# Altium project Задание.PrjPcb
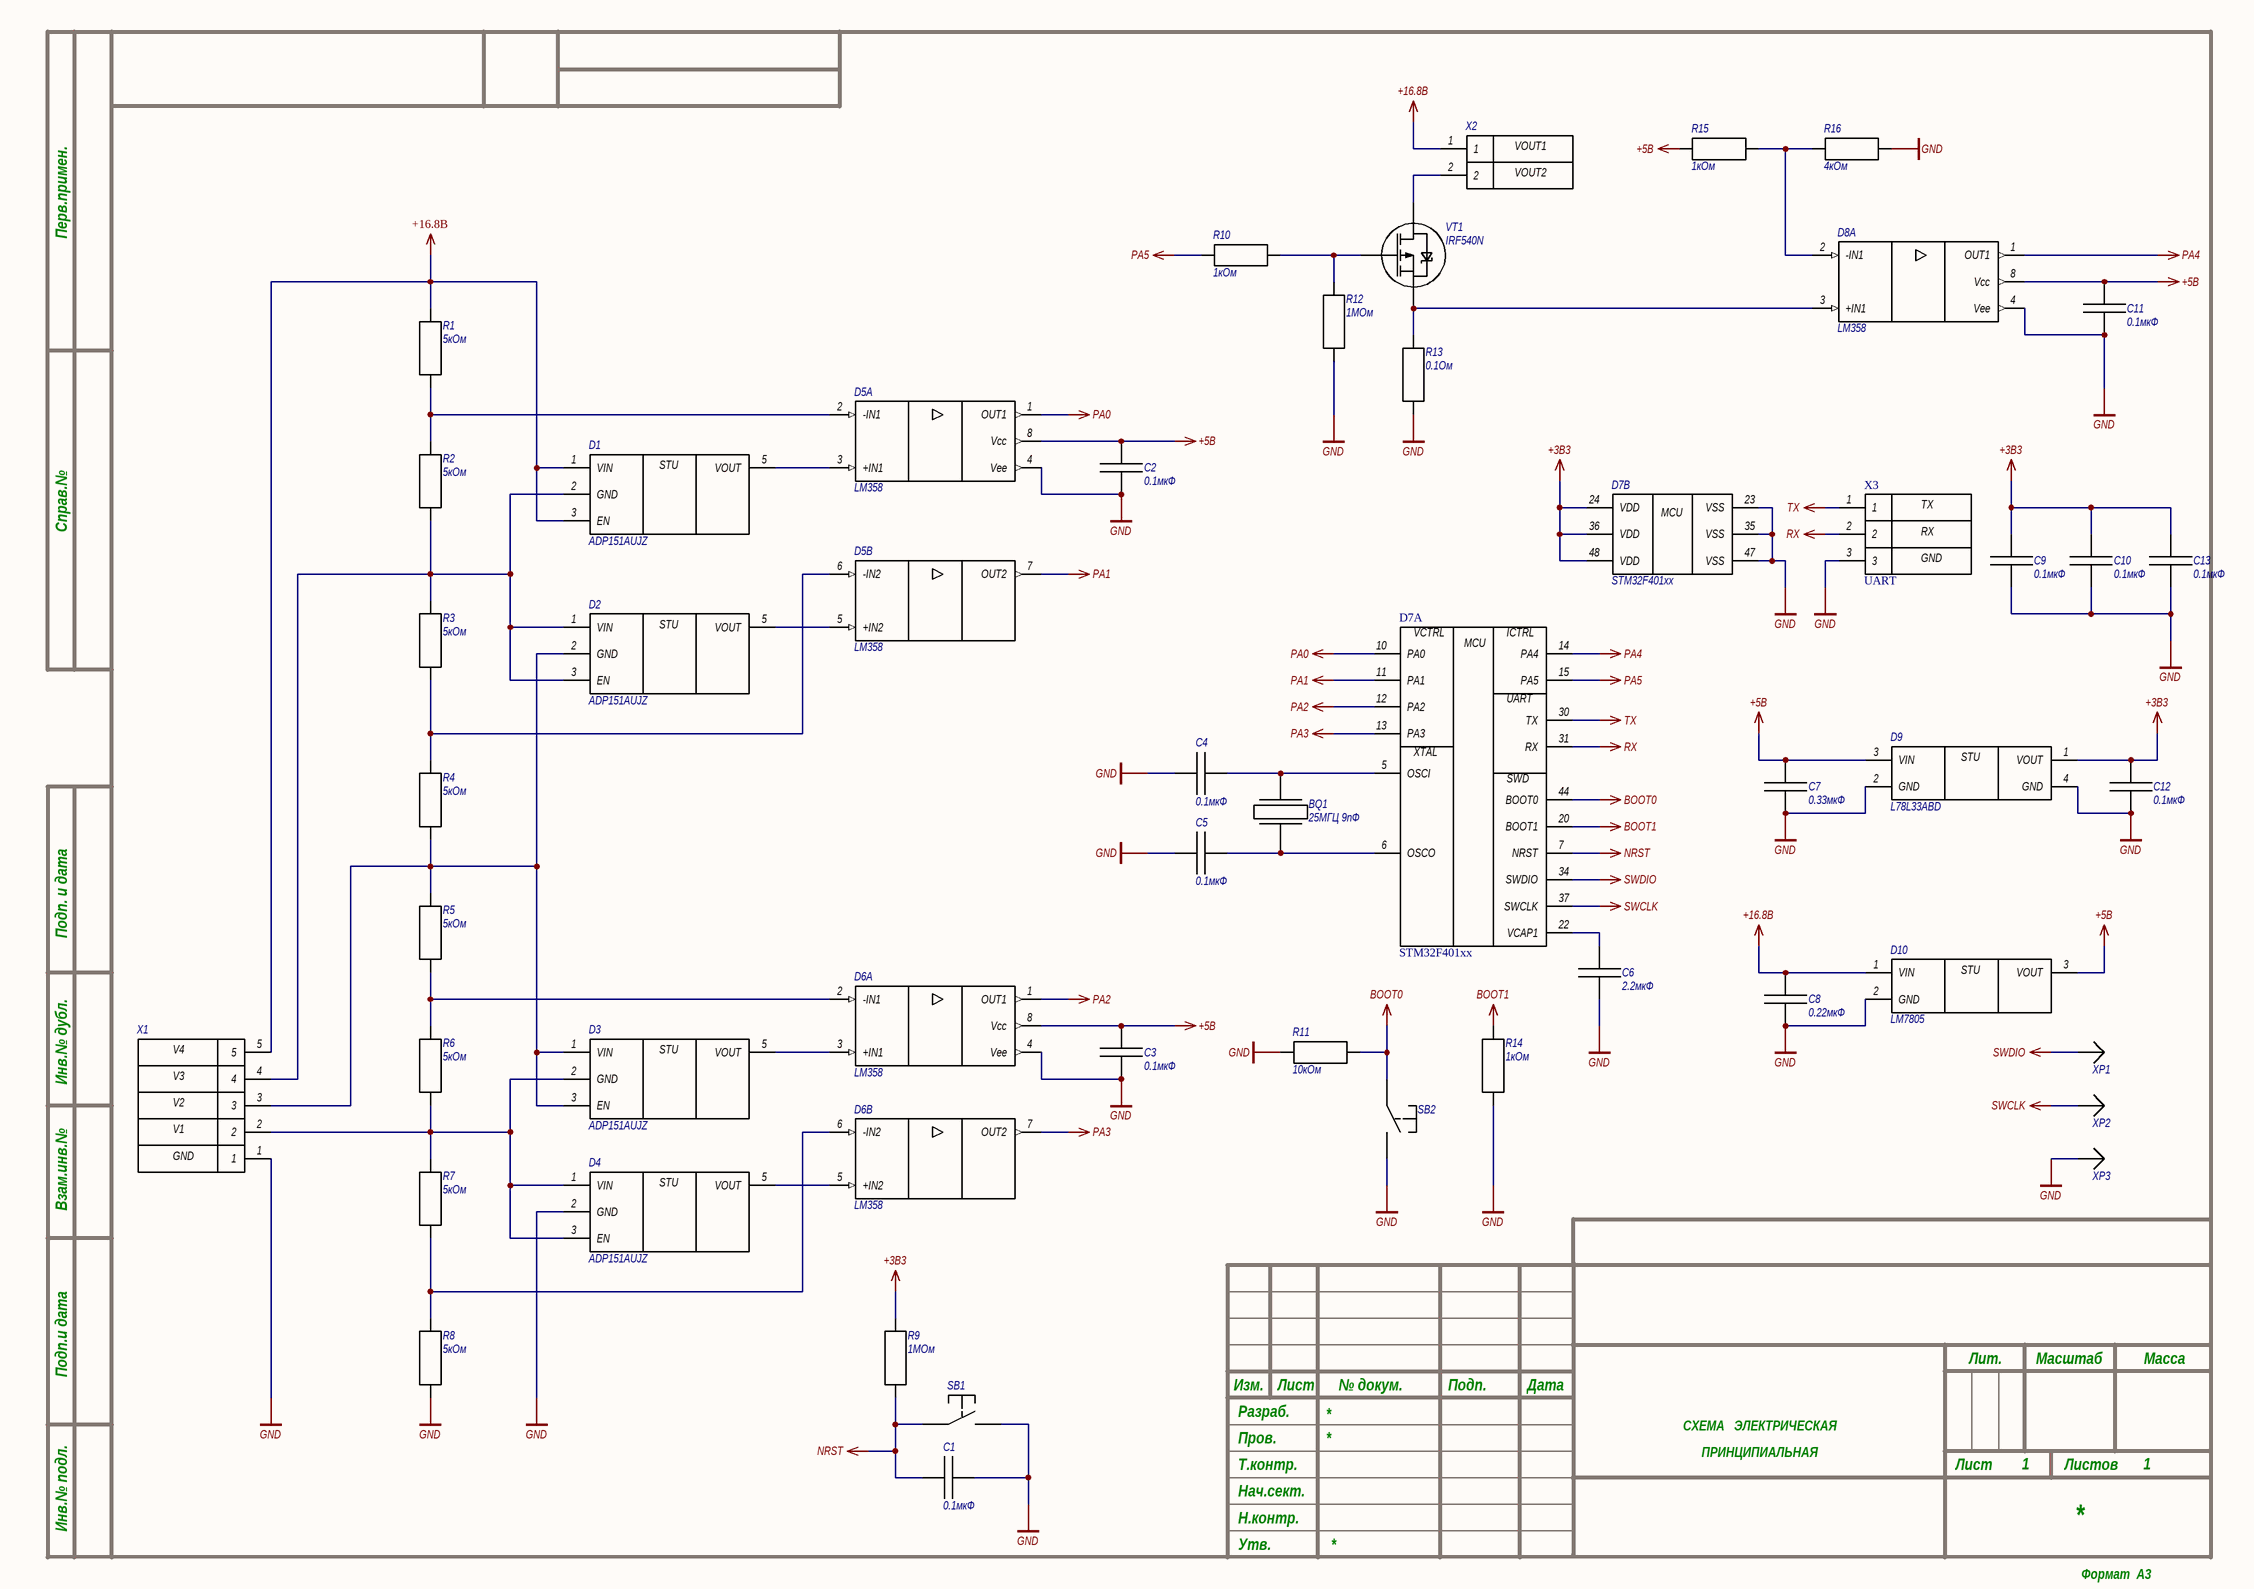
[diagram p0: Задание.SchDoc]
1 sheet, 49 parts. Net scope: global (net labels, ports and power ports of the same name join across sheets).

## Sheet Задание.SchDoc
size 420 x 297 mm; SheetNumber: 1; SheetTotal: 1

### Parts
BQ1  25МГЦ 9пФ
C1  0.1мкФ  [CAPC2012L-С0805]
C2  0.1мкФ  [CAPC2012L-С0805]
C3  0.1мкФ  [CAPC2012L-С0805]
C4  0.1мкФ  [CAPC2012L-С0805]
C5  0.1мкФ  [CAPC2012L-С0805]
C6  2.2мкФ  [CAPC2012L-С0805]
C7  0.33мкФ  [CAPC2012L-С0805]
C8  0.22мкФ  [CAPC2012L-С0805]
C9  0.1мкФ  [CAPC2012L-С0805]
C10  0.1мкФ  [CAPC2012L-С0805]
C11  0.1мкФ  [CAPC2012L-С0805]
C12  0.1мкФ  [CAPC2012L-С0805]
C13  0.1мкФ  [CAPC2012L-С0805]
D1  ADP151AUJZ
D2  ADP151AUJZ
D3  ADP151AUJZ
D4  ADP151AUJZ
D5  LM358  (parts A,B of 2)
D6  LM358  (parts A,B of 2)
D7  STM32F401xx  (parts A,B of 2)
D8  LM358  (part A of 2)
D9  L78L33ABD
D10  LM7805
R1  5кОм
R2  5кОм
R3  5кОм
R4  5кОм
R5  5кОм
R6  5кОм
R7  5кОм
R8  5кОм
R9  1МОм
R10  1кОм
R11  10кОм
R12  1МОм
R13  0.1Ом
R14  1кОм
R15  1кОм
R16  4кОм
SB1  Button  (value not drawn)
SB2  Button  (value not drawn)
VT1  IRF540N
X1  Klem5  (value not drawn)
X2  (no value)
X3  UART
XP1  PLS-1  [KlemmaD1]  (value not drawn)
XP2  PLS-1  [KlemmaD1]  (value not drawn)
XP3  PLS-1  [KlemmaD1]  (value not drawn)

### Nets
+3В3: C9.1 C10.1 C12.1 C13.1 D7.24(VDD) D7.36(VDD) D7.48(VDD) D9.1(VOUT) R9.1
+5В: C2.1 C3.1 C7.1 C11.1 D5.8(Vcc) D6.8(Vcc) D8.8(Vcc) D9.3(VIN) D10.3(VOUT) R15.2
+16.8В: C8.1 D1.1(VIN) D1.3(EN) D10.1(VIN) R1.1 X1.5 X2.1
BOOT0: D7.44(BOOT0) R11.1 SB2.54
BOOT1: D7.20(BOOT1) R14.1
GND: C1.2 C2.2 C3.2 C4.1 C5.1 C6.2 C7.2 C8.2 C9.2 C10.2 C11.2 C12.2 C13.2 D4.2(GND) D5.4(Vee) D6.4(Vee) D7.23(VSS) D7.35(VSS) D7.47(VSS) D8.4(Vee) D9.2(GND) D9.4(GND) D10.2(GND) R8.2 R11.2 R12.2 R13.2 R14.2 R16.1 SB1.55 SB2.55 X1.1 X3.3 XP3.1
NRST: C1.1 D7.7(NRST) R9.2 SB1.54
PA0: D5.1(OUT1) D7.10(PA0)
PA1: D5.7(OUT2) D7.11(PA1)
PA2: D6.1(OUT1) D7.12(PA2)
PA3: D6.7(OUT2) D7.13(PA3)
PA4: D7.14(PA4) D8.1(OUT1)
PA5: D7.15(PA5) R10.2
RX: D7.31(RX) X3.2
SWCLK: D7.37(SWCLK) XP2.1
SWDIO: D7.34(SWDIO) XP1.1
TX: D7.30(TX) X3.1
NetBQ1_52: BQ1.52 C5.2 D7.6(OSCO)
NetBQ1_53: BQ1.53 C4.2 D7.5(OSCI)
NetC6_1: C6.1 D7.22(VCAP1)
NetD1_2: D1.2(GND) D2.1(VIN) D2.3(EN) R2.2 R3.1 X1.4
NetD1_5: D1.5(VOUT) D5.3(+IN1)
NetD2_2: D2.2(GND) D3.1(VIN) D3.3(EN) R4.2 R5.1 X1.3
NetD2_5: D2.5(VOUT) D5.5(+IN2)
NetD3_2: D3.2(GND) D4.1(VIN) D4.3(EN) R6.2 R7.1 X1.2
NetD3_5: D3.5(VOUT) D6.3(+IN1)
NetD4_5: D4.5(VOUT) D6.5(+IN2)
NetD5_2: D5.2(-IN1) R1.2 R2.1
NetD5_6: D5.6(-IN2) R3.2 R4.1
NetD6_2: D6.2(-IN1) R5.2 R6.1
NetD6_6: D6.6(-IN2) R7.2 R8.1
NetD8_2: D8.2(-IN1) R15.1 R16.2
NetD8_3: D8.3(+IN1) R13.1 VT1.2(S)
NetR10_1: R10.1 R12.1 VT1.1(G)
NetVT1_3: VT1.3(D) X2.2

### Notes on the sheet
- (near X2) VOUT1
- (near X2) VOUT2
- V4
- V1
- V2
- V3
- (near X1) GND
- Перв.примен.
- Справ.№
- Подп. и дата
- Инв.№ дубл.
- Взам.инв.№
- Подп.и дата
- Разраб.
- Изм.
- Лист
- № докум.
- Подп.
- Дата
- Лит.
- Масштаб
- Масса
- Т.контр.
- Пров.
- СХЕМА   ЭЛЕКТРИЧЕСКАЯ
- ПРИНЦИПИАЛЬНАЯ
- Листов
- Инв.№ подл.
- Утв.
- Н.контр.
- Нач.сект.
- Формат  A3
- (in symbol ADP151AUJZ) STU
- (in symbol L78L33ABD) STU
- (in symbol LM7805) STU
- (in symbol RX/TX) TX; RX; GND
- (in symbol STM32F401xx, part A) VCTRL; ICTRL; MCU; UART; XTAL; SWD
- (in symbol STM32F401xx, part B) MCU

### Library data of the parts
BQ1 = Resonator
C1-C13 = C0805: планарный конденсатор
  C1-C5 C9-C13: Value: 0.1мкФ
  C6: Value: 2.2мкФ
  C7: Value: 0.33мкФ
  C8: Value: 0.22мкФ
R1-R16 = Res
X2 = Klem2
X3 = RX/TX